# Altium project Sensor_Box_PWR_DC.PrjPCB
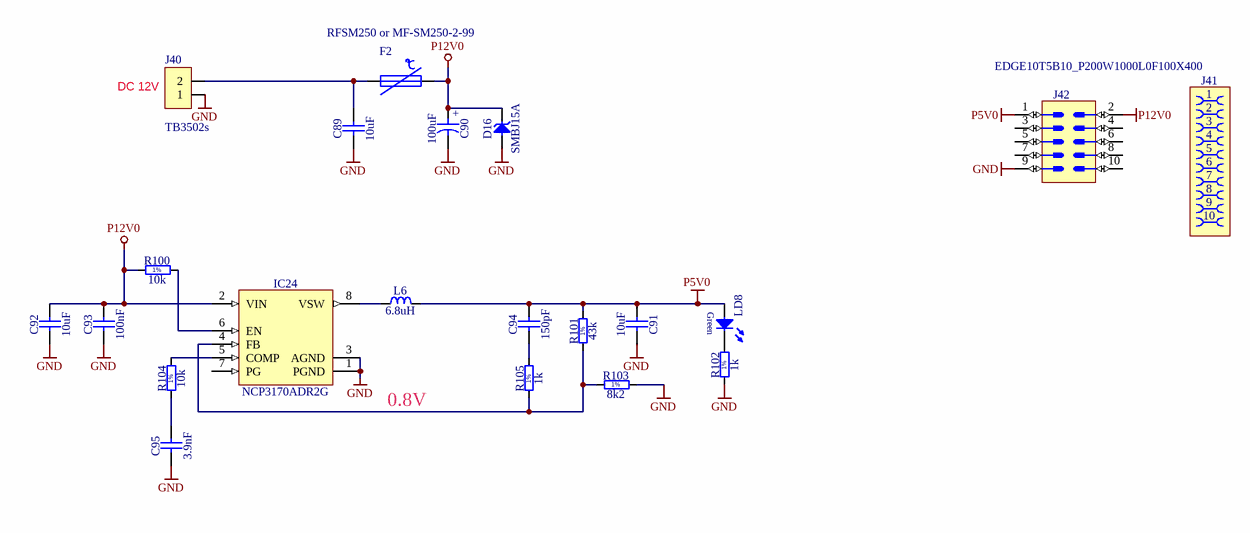
[diagram p0: Sensor_Box_PWR_DC.SchDoc]
1 sheet, 21 parts. Net scope: global (net labels, ports and power ports of the same name join across sheets).
Board file: Sensor_Box_PWR_DC.PCBDOC

## Sheet Sensor_Box_PWR_DC.SchDoc: Title
size 420 x 297 mm; Author: G.Kasprowicz; CompanyName: WUT ISE; DrawnBy: G.Kasprowicz; Organization: WUT ISE; Address1: PW ISE; Address2: Nowowiejska 15/19 00-665 Warsaw; Address3: gkasprow@gmail.com; Revision: 1.0; SheetNumber: -; SheetTotal: -; ModifiedBy: -; CheckedDate: -; Title2: Title2; DivGrp: WUT ISE; Designer: G.Kasprowicz; ModifiedDate: -; ProjectName: Sensor Box

### Parts
C89  10uF  [CAPC2012X135N]
C90  100uF  [CAPAE660X540N]
C91  10uF  [CAPC2012X135N]
C92  10uF  [CAPC2012X135N]
C93  100nF  [CAPC1005X55N]
C94  150pF  [CAPC1608X87N]
C95  3.9nF  [CAPC1608X87N]
D16  SMBJ15A  [DIOM5336X265N]
F2  RFSM250 or MF-SM250-2-99  [SMD150-2]
IC24  NCP3170ADR2G  [SOIC127P600X175-8N]
J40  TB3502s  [tbx3502s]
J41  (no value)  [AVX_00 9159 010 061 916]
J42  (no value)  [EDGE10T5B10_P200W1000L0F100X400]
L6  6.8uH  [IND_BOURNS_SRU8043]
LD8  Green  [LED_KINGBRIGHT_KPTR3216]  (value not drawn)
R100  10k  [RESC1005X40N]
R101  43k  [RESC1608X55N]
R102  1k  [RESC1005X40N]
R103  8k2  [RESC1608X55N]
R104  10k  [RESC1005X40N]
R105  1k  [RESC1005X40N]

### Nets
GND: C89.1 C90.2 C91.2 C92.1 C93.1 C95.1 D16.2(A) IC24.1(PGND) IC24.3(AGND) J40.1 J42.9 R102.1 R103.2
P5V0: C91.1 C94.2 J42.1 L6.2 LD8.2(A) R101.2
P12V0: C90.1 C92.2 C93.2 D16.1(C) F2.2 IC24.2(VIN) J42.2 R100.1
NetC89_2: C89.2 F2.1 J40.2
NetC94_1: C94.1 R105.2
NetC95_2: C95.2 R104.1
NetIC24_4: IC24.4(FB) R101.1 R103.1 R105.1
NetIC24_5: IC24.5(COMP) R104.2
NetIC24_6: IC24.6(EN) R100.2
NetIC24_8: IC24.8(VSW) L6.1
NetLD8_1: LD8.1(C) R102.2

Not connected (* = marked no-connect by the designer): IC24 7(PG); J42 3 4 5 6 7 8 10

### Notes on the sheet
- (near J40) DC 12V
- 0.8V
- Project/Equipment
- Document
- Designer
- Drawn by
- Check.by
- Copyright WUT ISE 2018.
  This documentation describes Open Hardware and is licensed under the CERN OHL v.1.1. You may redistribute and modify this documentation under the terms of the CERN OHL v.1.1. (http://ohwr.org/CERNOHL). This documentation is distributed WITHOUT ANY EXPRESS OR IMPLIED WARRANTY, INCLUDING OF MERCHANTABILITY, SATISFACTORY QUALITY AND FITNESS FOR A PARTICULAR PURPOSE. Please see the CERN OHL v.1.1 for applicable conditions.
- Contact
- File
- Last Mod.
- Print Date
- Sheet
- Size
- A3
- of
- Rev
- (in symbol CAE660-540_100UF_16V_20%) +
- (in symbol R0402_1K_1%_0.0625W_100PPM) 1%
- (in symbol R0402_10K_1%_0.0625W_100PPM) 1%
- (in symbol R0603_8K2_1%_0.1W_100PPM) 1%
- (in symbol R0603_43K_1%_0.1W_100PPM) 1%

### Library data of the parts
C89 C91 C92 = CC0805_10UF_16V_10%_X5R: Non-polarised capacitor; Part Description: SMD Multilayer Chip Ceramic Capacitor; Manufacturer: GENERIC; Manufacturer1 Part Number: C0805C106K4PAC; Voltage: 16V; TC: X5R; Tolerance: ±10%; Part Number: CC0805_10UF_16V_10%_X5R; Component Kind: Standard; Component Type: Standard; Pin Count: 2; Value: 10uF; Status: Preferred; Manufacturer Part Number: CC0805_10UF_16V_10%_X5R; Case: 0805; Mounted: Yes; Socket: No; SMD: Yes; Sense: No; Manufacturer1 Example: KEMET; Manufacturer1 ComponentHeight: 1.4mm; HelpURL: \\cern.ch\dfs\Applications\Altium\Datasheets\CC1206_X5R_KEMET.pdf; Author: CERN DEM JLC; CreateDate: 03.12.2007; LatestRevisionDate: 03.12.2007
C90 = CAE660-540_100UF_16V_20%: Polarised capacitor; Part Description: Aluminum Electrolytic SMT Capacitor; Manufacturer: PANASONIC; Manufacturer Part Number: EEEFK1C101AP; Voltage: 16V; Tolerance: ±20%; Part Number: CAE660-540_100UF_16V_20%; Component Kind: Standard; Component Type: Standard; Pin Count: 2; Value: 100uF; Status: Not Recommended; Case: D; Mounted: Yes; Socket: No; SMD: Yes; Sense: No; ComponentHeight: 5.8mm; HelpURL: \\cern.ch\dfs\Applications\Altium\Datasheets\CAE_PANASONIC_FK.pdf; Author: CERN DEM JLC; CreateDate: 03.12.2007; LatestRevisionDate: 05.11.2014
C93 = CC0402_100NF_16V_10%_X5R: Non-polarised capacitor; Part Description: SMD Multilayer Chip Ceramic Capacitor; Manufacturer: GENERIC; Manufacturer1 Part Number: GRM155R61C104KA88D; Voltage: 16V; TC: X5R; Tolerance: ±10%; Part Number: CC0402_100NF_16V_10%_X5R; Component Kind: Standard; Component Type: Standard; Pin Count: 2; Value: 100nF; Status: None; Manufacturer Part Number: CC0402_100NF_16V_10%_X5R; Case: 0402; Mounted: Yes; Socket: No; SMD: Yes; Sense: No; Manufacturer1 Example: MURATA; Manufacturer1 ComponentHeight: 0.55mm; HelpURL: \\cern.ch\dfs\Applications\Altium\Datasheets\CC0402_X5R_MURATA_GRM.pdf; Author: CERN DEM JLC; CreateDate: 10.12.2013; LatestRevisionDate: 10.12.2013
C94 = CC0603_150PF_50V_1%_NP0: Non-polarised capacitor; Part Description: SMD Multilayer Chip Ceramic Capacitor; Manufacturer: GENERIC; Manufacturer1 Part Number: CC0603FRNPO9BN151; Voltage: 50V; TC: C0G/NP0; Tolerance: ±1%; Part Number: CC0603_150PF_50V_1%_NP0; Component Kind: Standard; Component Type: Standard; Pin Count: 2; Value: 150pF; Status: None; Manufacturer Part Number: CC0603_150PF_50V_1%_NP0; Case: 0603; Mounted: Yes; Socket: No; SMD: Yes; Sense: No; Manufacturer1 Example: PHYCOMP; Manufacturer1 ComponentHeight: 0.7mm; HelpURL: \\cern.ch\dfs\Applications\Altium\Datasheets\CC0805_NP0_PHYCOMP_16VTO50V.pdf; Author: CERN DEM MR; CreateDate: 17.02.2016; LatestRevisionDate: 17.02.2016
C95 = CC0603_3.9NF_50V_5%_X7R: Non-polarised capacitor; Part Description: SMD Multilayer Chip Ceramic Capacitor; Manufacturer: GENERIC; Manufacturer1 Part Number: 223858615631; Voltage: 50V; TC: X7R; Tolerance: ±5%; Part Number: CC0603_3.9NF_50V_5%_X7R; Component Kind: Standard; Component Type: Standard; Pin Count: 2; Value: 3.9nF; Status: Preferred; Manufacturer Part Number: CC0603_3.9NF_50V_5%_X7R; Case: 0603; Mounted: Yes; Socket: No; SMD: Yes; Sense: No; Manufacturer1 Example: PHYCOMP; Manufacturer1 ComponentHeight: 0.87mm; HelpURL: \\cern.ch\dfs\Applications\Altium\Datasheets\CC0603_X7R_PHYCOMP.pdf; Author: CERN DEM JLC; CreateDate: 03.12.2007; LatestRevisionDate: 03.12.2007
D16 = SMBJ15A: Zener Diode; Part Description: Uni-Directional Transient Voltage Suppressor Diode; Manufacturer: FAIRCHILD SEMICONDUCTOR; Voltage: 15V; Power: 600W; PressFit: No; Bonding: No; Part Number: SMBJ15A; Component Kind: Standard; Component Type: Standard; Device: SMBJ15A; PackageDescription: DO-214-AA/SMB Diode, Molded Body; 5.34mm L X 3.625mm W X 2.65mm H, IPC Medium Density; Manufacturer Part Number: SMBJ15A; Pin Count: 2; Case: DO-214AA; Mounted: Yes; Socket: No; SMD: Yes; Sense: No; ComponentHeight: 2.65mm; HelpURL: \\cern.ch\dfs\Applications\Altium\Datasheets\SMBJ.pdf; Author: CERN DEM JLC; CreateDate: 08.12.2008; LatestRevisionDate: 19.12.2011
F2 = F_PTC_9.5x6mm: 2.50A/15V; Supplier 1: Newark; Supplier Part Number 1: 61J7435
IC24 = NCP3170ADR2G: Synchronous PWM Switching Converter; Manufacturer: ON SEMICONDUCTOR; PressFit: No; Bonding: No; Part Number: NCP3170ADR2G; Component Kind: Standard; Component Type: Standard; Device: NCP3170ADR2G; PackageDescription: SOIC 8, Pitch 1.27mm - Body 4x5mm, IPC Medium Density; Part Description: Synchronous PWM Switching Converter; Manufacturer Part Number: NCP3170ADR2G; Pin Count: 8; Case: SOIC8; Mounted: Yes; Socket: No; SMD: Yes; Sense: No; ComponentHeight: 1.75mm; Author: CERN DEM MR; HelpURL: \\cern.ch\dfs\Applications\Altium\Datasheets\NCP3170ADR2G.pdf; CreateDate: 30.05.2016; LatestRevisionDate: 30.05.2016
J40 = CON_TB2: Terminal Block
J41 = AVX_00 9159 010 061 916: Open Ended Card Edge Connector, 9159 Series; Part Description: 10 Contacts, 2mm Pitch, Open Ended Card Edge Connector, 9159 Series; Manufacturer: AVX; PressFit: No; Part Number: AVX_00 9159 010 061 916; Component Kind: Standard; Component Type: Standard; Pin Count: 10; Mounted: Yes; Socket: No; SMD: No; Sense: No; Status: None; Manufacturer Part Number: 00 9159 010 061 916; ComponentHeight: 1.6mm; HelpURL: \\cern.ch\dfs\Applications\Altium\Datasheets\AVX_00 9159 010 061 916.pdf; Author: CERN DEM MR; CreateDate: 13.02.2018; LatestRevisionDate: 13.02.2018
J42 = EDGE10T5B10_P200W1000L0F100X400: PCB Edge Connector 10 (2x5); Part Description: 10 Contacts Board Edge Connector, Pitch 2mm, Length 0mm, Width 10mm, Finger Lenght 4mm, Finger Width 1mm; Mounted: No; PressFit: No; Part Number: EDGE10T5B10_P200W1000L0F100X400; Component Kind: Standard (No BOM); Component Type: Standard (No BOM); Pin Count: 10; Socket: No; SMD: No; Sense: No; Status: None; ComponentHeight: 0mm; HelpURL: \\cern.ch\dfs\Applications\Altium\Datasheets\EDGE10T5B10_P200W1000L0F100X400.pdf; Author: CERN DEM MR; CreateDate: 14.02.2018; LatestRevisionDate: 14.02.2018
L6 = IND_6.8UH_30%_BOURNS_SRU8043: Inductor; Part Description: Shielded SMD Power Inductor; Manufacturer: BOURNS; Manufacturer Part Number: SRU8043-6R8Y; Power: 3.8A; Resistance: 0.0224R; Tolerance: ±30%; Part Number: IND_6.8UH_30%_BOURNS_SRU8043; Component Kind: Standard; Component Type: Standard; Pin Count: 2; Value: 6.8uH; Status: None; Mounted: Yes; Socket: No; SMD: Yes; Sense: No; ComponentHeight: 4.6mm; HelpURL: \\cern.ch\dfs\Applications\Altium\Datasheets\IND_BOURNS_SRU8043.pdf; Author: CERN DEM JMW; CreateDate: 06.08.2015; LatestRevisionDate: 06.08.2015
LD8 = LED_KINGBRIGHT_KPTR-3216CGCK: LED Green 1A 2C; Part Description: Reverse Mount LED 1.4x1.6mm Green; PressFit: No; Bonding: No; Part Number: LED_KINGBRIGHT_KPTR-3216CGCK; Component Kind: Standard; Component Type: Standard; Color: Green; PackageDescription: Reverse Mount LED 3216, Hole 2.1x2.3mm 0.35mm Height; Manufacturer: KINGBRIGHT; Manufacturer Part Number: KPTR-3216CGCK; Pin Count: 2; Mounted: Yes; Socket: No; SMD: Yes; Sense: No; ComponentHeight: 0.35mm; HelpURL: \\cern.ch\dfs\Applications\Altium\Datasheets\LED_KINGBRIGHT_KPTR-3216CGCK.pdf; Author: CERN DEM MR; CreateDate: 15.02.2016; LatestRevisionDate: 15.02.2016
R100 R104 = R0402_10K_1%_0.0625W_100PPM: Resistor - 1%; Part Description: General Purpose Thick Film Chip Resistor; Manufacturer: GENERIC; Manufacturer1 Part Number: 232270671003L; TC: ±100ppm/°C; PressFit: No; Part Number: R0402_10K_1%_0.0625W_100PPM; Component Kind: Standard; Component Type: Standard; Pin Count: 2; Value: 10k; Status: Not Recommended; Power: 0.0625W; Tolerance: ±1%; Manufacturer Part Number: R0402_10K_1%_0.0625W_100PPM; Case: 0402; Mounted: Yes; Sense: No; Socket: No; SMD: Yes; Manufacturer1 Example: YAGEO PHYCOMP; Manufacturer1 ComponentHeight: 0.4mm; HelpURL: \\cern.ch\dfs\Applications\Altium\Datasheets\R0402_Phycomp_RC0402.pdf; Author: CERN DEM JLC; CreateDate: 03.12.2007; LatestRevisionDate: 17.10.2012
R101 = R0603_43K_1%_0.1W_100PPM: Resistor - 1%; Part Description: General Purpose Thick Film Chip Resistor; Manufacturer: GENERIC; Manufacturer1 Part Number: NRC06F4302TRF; Power: 0.1W; TC: ±100ppm/°C; PressFit: No; Part Number: R0603_43K_1%_0.1W_100PPM; Component Kind: Standard; Component Type: Standard; Pin Count: 2; Value: 43k; Status: Preferred; Tolerance: ±1%; Manufacturer Part Number: R0603_43K_1%_0.1W_100PPM; Case: 0603; Mounted: Yes; Sense: No; Socket: No; SMD: Yes; Manufacturer1 Example: NIC COMPONENT; Manufacturer1 ComponentHeight: 0.55mm; HelpURL: \\cern.ch\dfs\Applications\Altium\Datasheets\R0603_NIC_NRC.pdf; Author: CERN DEM JLC; CreateDate: 03.12.2007; LatestRevisionDate: 13.03.2008
R102 R105 = R0402_1K_1%_0.0625W_100PPM: Resistor - 1%; Part Description: General Purpose Thick Film Chip Resistor; Manufacturer: GENERIC; Manufacturer1 Part Number: 232270671002L; TC: ±100ppm/°C; PressFit: No; Part Number: R0402_1K_1%_0.0625W_100PPM; Component Kind: Standard; Component Type: Standard; Pin Count: 2; Value: 1k; Status: Not Recommended; Power: 0.0625W; Tolerance: ±1%; Manufacturer Part Number: R0402_1K_1%_0.0625W_100PPM; Case: 0402; Mounted: Yes; Sense: No; Socket: No; SMD: Yes; Manufacturer1 Example: YAGEO PHYCOMP; Manufacturer1 ComponentHeight: 0.4mm; HelpURL: \\cern.ch\dfs\Applications\Altium\Datasheets\R0402_Phycomp_RC0402.pdf; Author: CERN DEM JLC; CreateDate: 03.12.2007; LatestRevisionDate: 17.10.2012
R103 = R0603_8K2_1%_0.1W_100PPM: Resistor - 1%; Part Description: General Purpose Thick Film Chip Resistor; Manufacturer: GENERIC; Manufacturer1 Part Number: NRC06F8201TRF; Power: 0.1W; TC: ±100ppm/°C; PressFit: No; Part Number: R0603_8K2_1%_0.1W_100PPM; Component Kind: Standard; Component Type: Standard; Pin Count: 2; Value: 8k2; Status: Preferred; Tolerance: ±1%; Manufacturer Part Number: R0603_8K2_1%_0.1W_100PPM; Case: 0603; Mounted: Yes; Sense: No; Socket: No; SMD: Yes; Manufacturer1 Example: NIC COMPONENT; Manufacturer1 ComponentHeight: 0.55mm; HelpURL: \\cern.ch\dfs\Applications\Altium\Datasheets\R0603_NIC_NRC.pdf; Author: CERN DEM JLC; CreateDate: 03.12.2007; LatestRevisionDate: 13.03.2008